# EAGLE design MCU (EAGLE 9.6.2)
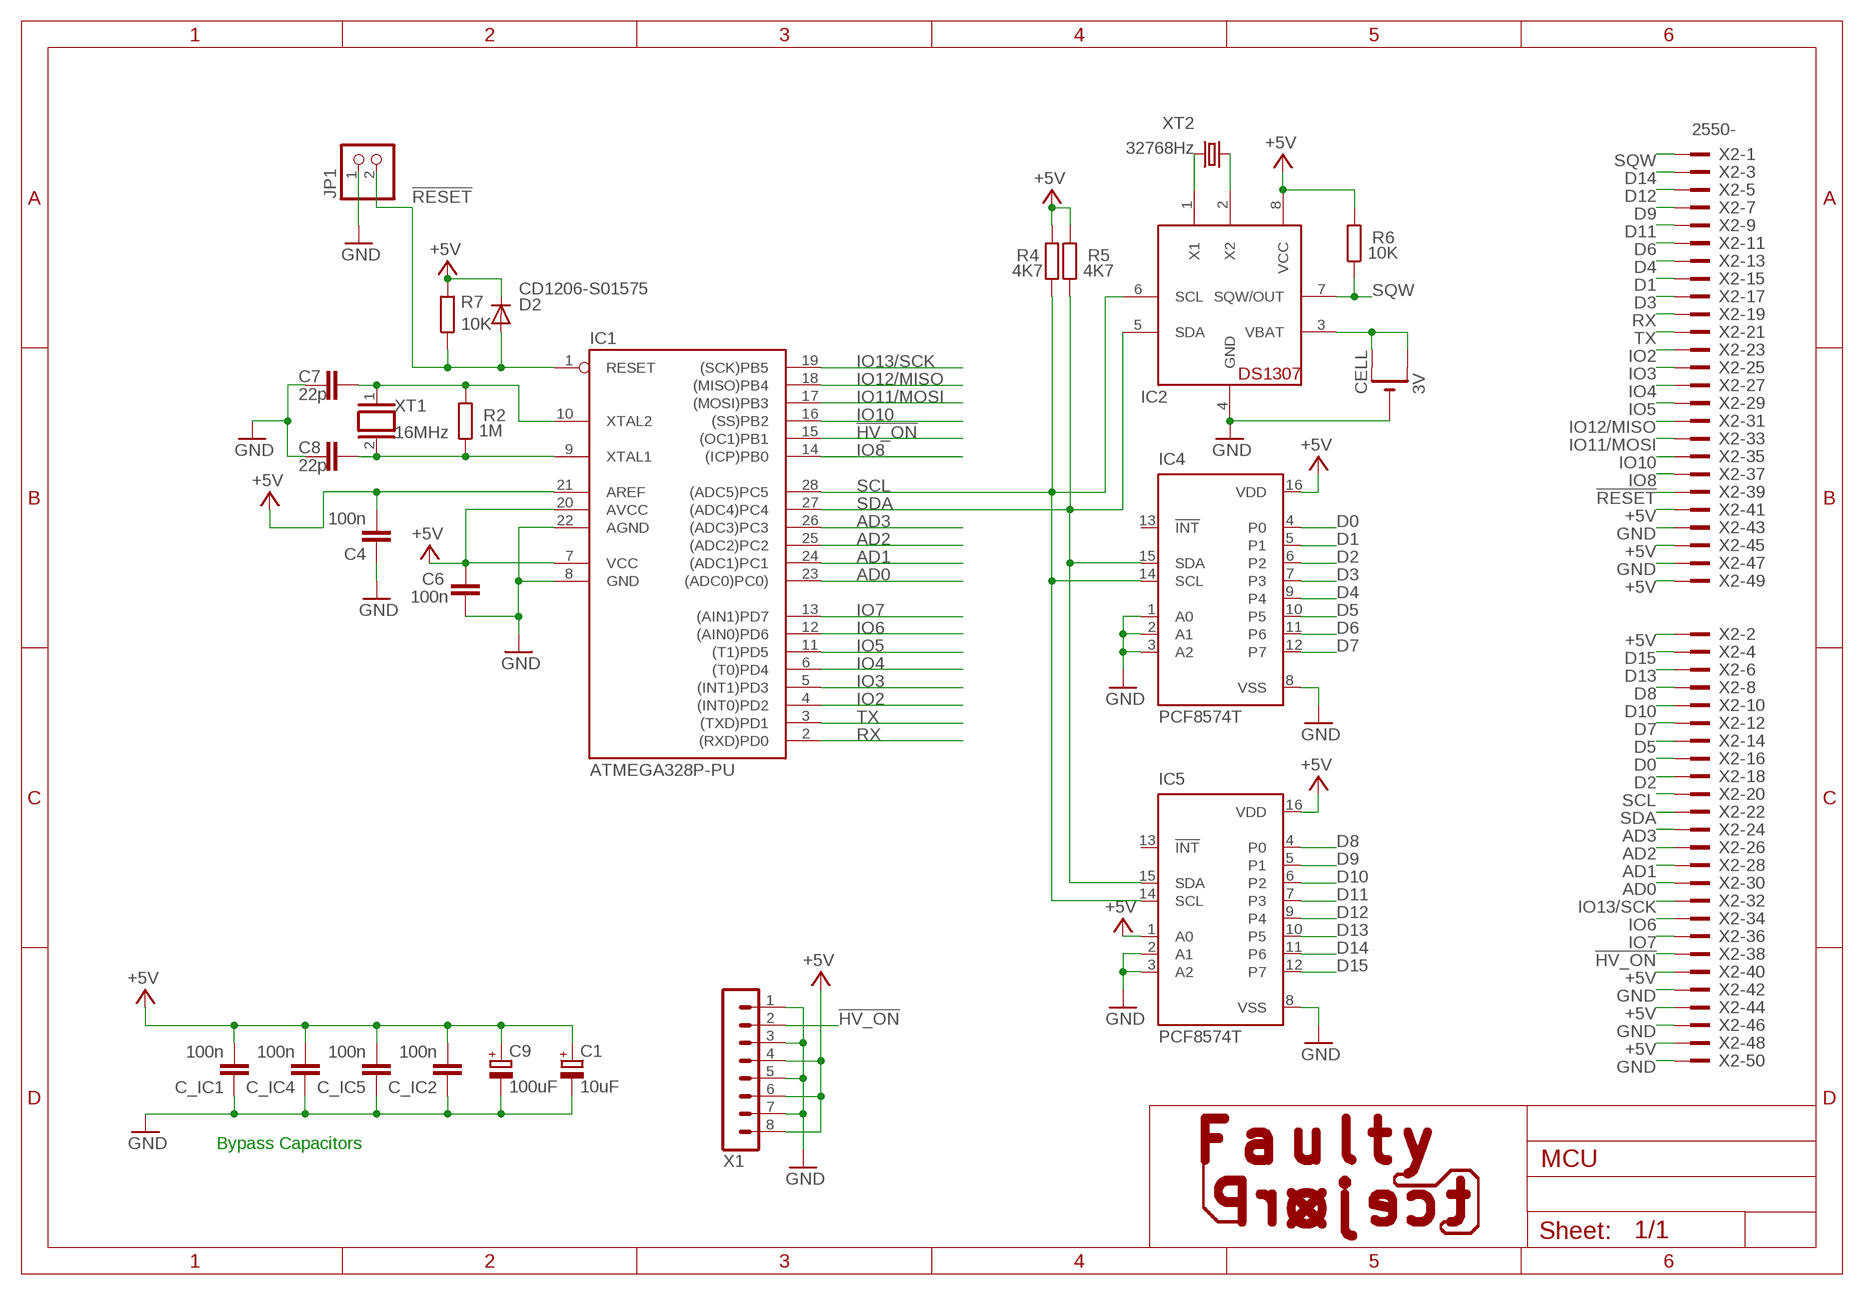
[diagram p0: schematic, sheet 1]

## Parts
C1  10uF  CPOL-EU085CS-1AR  [085CS_1AR]
C4  100n  C-EUC1206  [C1206]
C6  100n  C-EUC1206  [C1206]
C7  22p  C-EUC1206  [C1206]
C8  22p  C-EUC1206  [C1206]
C9  100uF  CPOL-EUE5-10.5  [E5-10,5]
C_IC1  100n  C-EUC1206  [C1206]
C_IC2  100n  C-EUC1206  [C1206]
C_IC4  100n  C-EUC1206  [C1206]
C_IC5  100n  C-EUC1206  [C1206]
CELL  3V  CR2032THM  [CR2032-THRU]
D2  CD1206-S01575  1N4004  [DO41-10]
IC1  ATMEGA328P-PU  [DIL28-3]
IC2  DS1307  [DIL08]
IC4  PCF8574T  [SO16W]
IC5  PCF8574T  [SO16W]
JP1  PINHD-1X2  [1X02]
R2  1M  R-EU_M1206  [M1206]
R4  4K7  R-EU_M1206  [M1206]
R5  4K7  R-EU_M1206  [M1206]
R6  10K  R-EU_M1206  [M1206]
R7  10K  R-EU_M1206  [M1206]
X1  MA08-1W  [MA08-1W]
X2  2550-  [PAK100/2500-50]
XT1  16MHz  XTAL/S  [QS]
XT2  32768Hz  CRYSTALTC26H  [TC26H]

## Nets
!HV_ON: IC1.15((OC1)PB1) X1.2 X2.38
!RESET: D2.A IC1.1(RESET) JP1.2 R7.1 X2.39
+5V [usbvcc]: C1.+ C4.2 C6.2 C9.+ C_IC1.2 C_IC2.2 C_IC4.2 C_IC5.2 D2.C IC1.7(VCC) IC1.20(AVCC) IC1.21(AREF) IC2.8(VCC) IC4.16(VDD) IC5.1(A0) IC5.16(VDD) R4.2 R5.2 R6.2 R7.2 X1.4 X1.6 X1.8 X2.2 X2.40 X2.41 X2.44 X2.45 X2.48 X2.49
AD0: IC1.23((ADC0)PC0)) X2.30
AD1: IC1.24((ADC1)PC1) X2.28
AD2: IC1.25((ADC2)PC2) X2.26
AD3: IC1.26((ADC3)PC3) X2.24
D0: IC4.4(P0) X2.16
D1: IC4.5(P1) X2.15
D2: IC4.6(P2) X2.18
D3: IC4.7(P3) X2.17
D4: IC4.9(P4) X2.13
D5: IC4.10(P5) X2.14
D6: IC4.11(P6) X2.11
D7: IC4.12(P7) X2.12
D8: IC5.4(P0) X2.8
D9: IC5.5(P1) X2.7
D10: IC5.6(P2) X2.10
D11: IC5.7(P3) X2.9
D12: IC5.9(P4) X2.5
D13: IC5.10(P5) X2.6
D14: IC5.11(P6) X2.3
D15: IC5.12(P7) X2.4
GND [gnd]: C1.- C4.1 C6.1 C7.1 C8.1 C9.- C_IC1.1 C_IC2.1 C_IC4.1 C_IC5.1 CELL.- IC1.8(GND) IC1.22(AGND) IC2.4(GND) IC4.1(A0) IC4.2(A1) IC4.3(A2) IC4.8(VSS) IC5.2(A1) IC5.3(A2) IC5.8(VSS) JP1.1 X1.1 X1.3 X1.5 X1.7 X2.42 X2.43 X2.46 X2.47 X2.50
IO2: IC1.4((INT0)PD2) X2.23
IO3: IC1.5((INT1)PD3) X2.25
IO4: IC1.6((T0)PD4) X2.27
IO5: IC1.11((T1)PD5) X2.29
IO6: IC1.12((AIN0)PD6) X2.34
IO7: IC1.13((AIN1)PD7) X2.36
IO8: IC1.14((ICP)PB0) X2.37
IO10: IC1.16((SS)PB2) X2.35
IO11/MOSI: IC1.17((MOSI)PB3) X2.33
IO12/MISO: IC1.18((MISO)PB4) X2.31
IO13/SCK: IC1.19((SCK)PB5) X2.32
RX: IC1.2((RXD)PD0) X2.19
SCL: IC1.28((ADC5)PC5) IC2.6(SCL) IC4.14(SCL) IC5.14(SCL) R4.1 X2.20
SDA: IC1.27((ADC4)PC4) IC2.5(SDA) IC4.15(SDA) IC5.15(SDA) R5.1 X2.22
SQW: IC2.7(SQW/OUT) R6.1 X2.1
TX: IC1.3((TXD)PD1) X2.21
VBAT: CELL.+1(+) CELL.+2(+1) IC2.3(VBAT)
X1_RTC: IC2.1(X1) XT2.2
X2_RTC: IC2.2(X2) XT2.1
XTAL1: C8.2 IC1.9(XTAL1) R2.1 XT1.2
XTAL2: C7.2 IC1.10(XTAL2) R2.2 XT1.1
Unconnected: IC4.13(!INT) IC5.13(!INT)

## Notes on the sheet
- Bypass Capacitors

## Library data of the parts
C1 C9 = rcl:CPOL-EU: POLARIZED CAPACITOR, European symbol
C4 C6-C8 C_IC1 C_IC2 C_IC4 C_IC5 = rcl:C-EU: CAPACITOR, European symbol
CELL = adafruit:CR2032
D2 = diode:1N4004: DIODE general purpose rectifier, 1 A
IC1 = SmartPrj:ATMEGA328P-: MICROCONTROLLER 4 Kbytes FLASH 128 bytes SRAM 256 bytes EEPROM UART 6-channel 10 bit ADC
IC2 = adafruit:DS1307: DS1307 Real time clock (RTC) with battery backup ability. Talk to it via i2c
IC4 IC5 = micro-philips:PCF8574: I2C-Bus Remote 8-bit I/O expander http://www.semiconductors.philips.com/acrobat_download/datasheets/PCF8574_4.pdf; MPN: PCF8574T/3,512; OC_FARNELL: 1201255; OC_NEWARK: 70R6870
JP1 = pinhead:PINHD-1X2: PIN HEADER
R2 R4-R7 = rcl:R-EU_: RESISTOR, European symbol
X1 = con-lstb:MA08-1W: PIN HEADER; OC_FARNELL: unknown; OC_NEWARK: unknown
X2 = con-3m:2550-: 3M (TM) Pak 100 4-Wall Header Source: 3M; OC_FARNELL: unknown; OC_NEWARK: unknown
XT1 = special:XTAL/S: CRYSTAL
XT2 = adafruit:CRYSTAL: CRYSTAL; OC_FARNELL: unknown; OC_NEWARK: unknown

## Net classes
0 default: width 0.254 mm, clearance 0.254 mm
1 power: width 0.61 mm, drill 0.61 mm, clearance 0.254 mm
2 gnd: width 0.305 mm, drill 0.559 mm, clearance 0.254 mm
3 usbvcc: width 0.508 mm, drill 0.61 mm, clearance 0.254 mm
4 aref: width 0.406 mm, drill 0.61 mm, clearance 0.254 mm

## Board
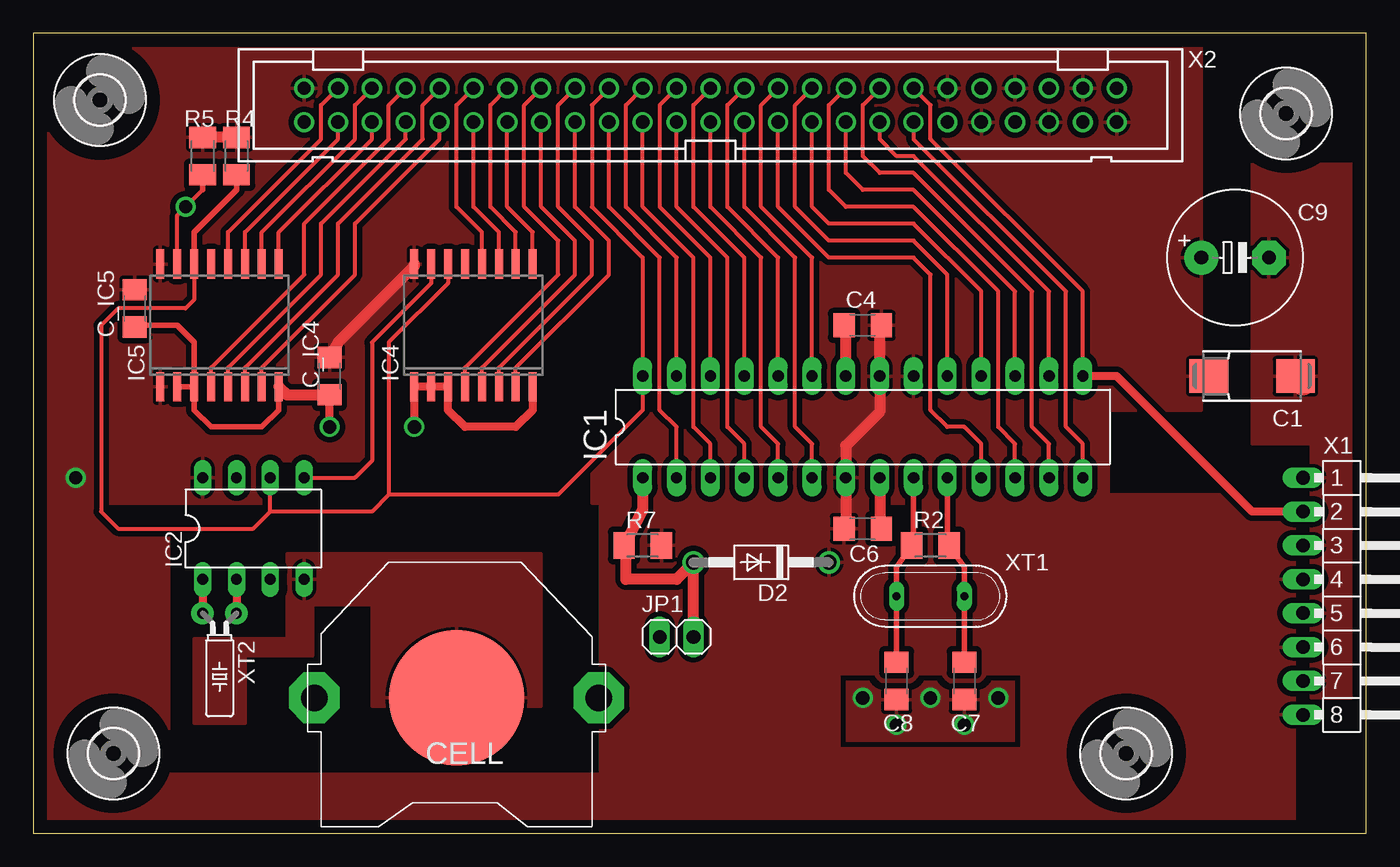
[diagram p1: board, top side]
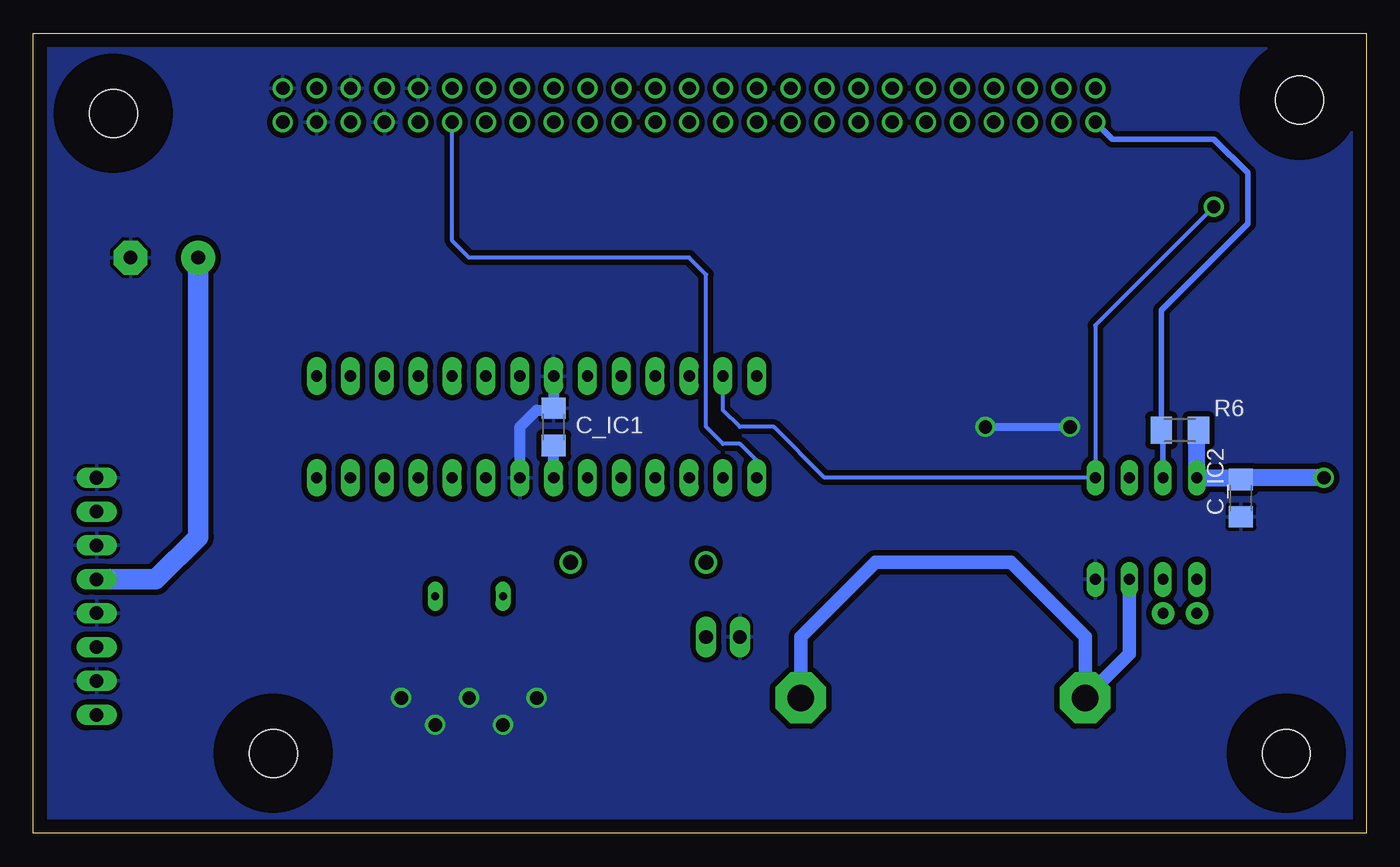
[diagram p2: board, bottom side, seen from below]

Size 100 x 60 mm. Coordinates in mm from the lower left corner, seen from the top.
Outline: 0,0 100,0 100,60 0,60 0,0
Copper layers (1*16): Top 0.035mm / dielectric 1.5mm / Bottom 0.035mm
Design rules "default": minimum track width 10mil, minimum drill 24mil, track to track 8mil, track to pad 8mil, pad to pad 8mil, via to via 8mil, smd to smd 8mil, copper to edge 40mil, drill to drill 8mil, minimum pad ring 10mil, minimum via ring 8mil, stop-mask expansion 4mil, vias tented up to drill 0mil, thermal gap 10mil

### Footprints (pad centres in the part's own frame; a part is rotated, then mirrored left to right if it is on the bottom)
085CS_1AR = smd 2.9 x 2.5: + 3.25,0; - -3.25,0
C1206 = smd 1.6 x 1.8: 1 -1.4,0; 2 1.4,0
E5-10,5 = drill 1.016 pad 2.54: + -2.54,0 | drill 1.016 pad 2.54 octagon: - 2.54,0
CR2032-THRU = drill 2 pad 3.81 octagon: +1 -10.668,0; +2 10.668,0 | smd 10.16 x 10.16: - 0,0
DO41-10 = drill 1.118: A 5.08,0; C -5.08,0
DIL28-3 = drill 0.85 pad 1.422 long: 1 -16.51,-3.81; 2 -13.97,-3.81; 3 -11.43,-3.81; 4 -8.89,-3.81; 5 -6.35,-3.81; 6 -3.81,-3.81; 7 -1.27,-3.81; 8 1.27,-3.81; 9 3.81,-3.81; 10 6.35,-3.81; 11 8.89,-3.81; 12 11.43,-3.81; 13 13.97,-3.81; 14 16.51,-3.81; 15 16.51,3.81; 16 13.97,3.81; 17 11.43,3.81; 18 8.89,3.81; 19 6.35,3.81; 20 3.81,3.81; 21 1.27,3.81; 22 -1.27,3.81; 23 -3.81,3.81; 24 -6.35,3.81; 25 -8.89,3.81; 26 -11.43,3.81; 27 -13.97,3.81; 28 -16.51,3.81
DIL08 = drill 0.813 long: 1 -3.81,-3.81; 2 -1.27,-3.81; 3 1.27,-3.81; 4 3.81,-3.81; 5 3.81,3.81; 6 1.27,3.81; 7 -1.27,3.81; 8 -3.81,3.81
SO16W = smd 0.6 x 2.2: 1 -4.445,-4.6; 2 -3.175,-4.6; 3 -1.905,-4.6; 4 -0.635,-4.6; 5 0.635,-4.6; 6 1.905,-4.6; 7 3.175,-4.6; 8 4.445,-4.6; 9 4.445,4.6; 10 3.175,4.6; 11 1.905,4.6; 12 0.635,4.6; 13 -0.635,4.6; 14 -1.905,4.6; 15 -3.175,4.6; 16 -4.445,4.6
1X02 = drill 1.016 long: 1 -1.27,0; 2 1.27,0
M1206 = smd 1.6 x 2: 1 -1.4,0; 2 1.4,0
3,6 = hole 3.6: 0,0
MA08-1W = drill 1.016 long: 1 -8.89,0; 2 -6.35,0; 3 -3.81,0; 4 -1.27,0; 5 1.27,0; 6 3.81,0; 7 6.35,0; 8 8.89,0
PAK100/2500-50 = drill 1 pad 1.422: 1 -30.48,-1.27; 2 -30.48,1.27; 3 -27.94,-1.27; 4 -27.94,1.27; 5 -25.4,-1.27; 6 -25.4,1.27; 7 -22.86,-1.27; 8 -22.86,1.27; 9 -20.32,-1.27; 10 -20.32,1.27; 11 -17.78,-1.27; 12 -17.78,1.27; 13 -15.24,-1.27; 14 -15.24,1.27; 15 -12.7,-1.27; 16 -12.7,1.27; 17 -10.16,-1.27; 18 -10.16,1.27; 19 -7.62,-1.27; 20 -7.62,1.27; 21 -5.08,-1.27; 22 -5.08,1.27; 23 -2.54,-1.27; 24 -2.54,1.27; 25 0,-1.27; 26 0,1.27; 27 2.54,-1.27; 28 2.54,1.27; 29 5.08,-1.27; 30 5.08,1.27; 31 7.62,-1.27; 32 7.62,1.27; 33 10.16,-1.27; 34 10.16,1.27; 35 12.7,-1.27; 36 12.7,1.27; 37 15.24,-1.27; 38 15.24,1.27; 39 17.78,-1.27; 40 17.78,1.27; 41 20.32,-1.27; 42 20.32,1.27; 43 22.86,-1.27; 44 22.86,1.27; 45 25.4,-1.27; 46 25.4,1.27; 47 27.94,-1.27; 48 27.94,1.27; 49 30.48,-1.27; 50 30.48,1.27
QS = drill 0.61 long: 1 -2.54,0; 2 2.54,0
TC26H = drill 0.813 pad 1.676: 1 -1.27,0; 2 1.27,0

### Placement (x,y rotation side)
C1  91.44,34.29 180 top
C4  62.23,38.1 0 top
C6  62.23,22.86 180 top
C7  69.85,11.43 90 top
C8  64.77,11.43 90 top
C9  90.17,43.18 0 top
C_IC1  60.96,30.48 270 bottom
C_IC2  9.4,25.15 90 bottom
C_IC4  22.23,34.29 90 top
C_IC5  7.62,39.37 90 top
CELL  31.75,10.16 180 top
D2  54.61,20.32 180 top
IC1  62.23,30.48 0 top
IC2  16.51,22.86 0 top
IC4  33.02,38.1 0 top
IC5  13.97,38.1 0 top
JP1  48.26,14.73 0 top
R2  67.31,21.59 0 top
R4  15.24,50.8 90 top
R5  12.7,50.8 90 top
R6  13.97,30.23 0 bottom
R7  45.72,21.59 0 top
U$1  [3,6]  5,55 0 top
U$2  [3,6]  94,54 0 top
U$3  [3,6]  6,6 0 top
U$4  [3,6]  82,6 0 top
X1  95.25,17.78 270 top
X2  50.8,54.61 0 top
XT1  67.31,17.78 180 top
XT2  13.97,16.51 180 top

### Tracks (layer width: path | path; a pad name or v marks a point on that pad's centre or on a via)
!HV_ON
  Top 0.305: IC1.15 78.74,40.64 67.31,52.07 67.31,54.61 X2.38
  Top 0.61: X1.2 91.44,24.13 81.28,34.29 IC1.15
!RESET
  Top 0.813: IC1.1 45.72,24.26 R7.1 44.45,21.46 44.45,19.05 48.26,19.05 D2.A JP1.2
  Bottom 0.305: IC1.1 45.72,27.94 46.99,29.21 48.26,29.21 49.53,30.48 49.53,41.91 50.8,43.18 67.31,43.18 68.58,44.45 X2.39
+5V  (via drill 1)
  Top 0.813: C4.2 63.5,37.72 IC1.21 63.5,31.62 C_IC1.2 IC1.7 60.96,23.24 C6.2 | IC4.16 28.57,42.55 22.86,36.83 C_IC4.2 | R4.2 R5.2
  Bottom 0.813: IC1.7 C_IC1.2
  Bottom 1.27: v3.17,26.67 9.27,26.67 | 9.27,26.67 C_IC2.2 | 9.27,26.67 IC2.8 12.7,30.1 R6.2
  Bottom 1.524: X1.4 90.81,19.05 87.63,22.23 C9.+
  pour Top (isolate 0.406, rank 2): 80.64,31.75 87.63,31.75 87.63,59.05 0,59.05 0,24.77 17.78,24.77 17.78,27.94 41.91,27.94 41.91,24.77 80.64,24.77
  pour Top (isolate 0.406, rank 2): 0,25.4 0,0 94.61,0 94.61,25.4 42.55,25.4 42.55,4.45 10.16,4.45 10.16,25.4
AD0
  Top 0.305: IC1.23 58.42,43.18 54.61,46.99 54.61,54.61 X2.30
AD1
  Top 0.305: IC1.24 55.88,43.18 52.07,46.99 52.07,54.61 X2.28
AD2
  Top 0.305: IC1.25 53.34,43.18 49.53,46.99 49.53,54.61 X2.26
AD3
  Top 0.305: IC1.26 50.8,43.18 46.99,46.99 46.99,54.61 X2.24
D0
  Top 0.305: IC4.4 32.38,34.92 39.37,41.91 39.37,44.45 36.83,46.99 36.83,54.61 X2.16
D1
  Top 0.305: IC4.5 33.66,34.92 40.64,41.91 40.64,44.45 38.1,46.99 X2.15
D2
  Top 0.305: IC4.6 34.92,34.92 41.91,41.91 41.91,44.45 39.37,46.99 39.37,54.61 X2.18
D3
  Top 0.305: IC4.7 36.2,34.92 43.18,41.91 43.18,44.45 40.64,46.99 X2.17
D4
  Top 0.305: X2.13 35.56,46.99 37.47,45.09 IC4.9
D5
  Top 0.305: X2.14 34.29,54.61 34.29,46.99 36.2,45.09 IC4.10
D6
  Top 0.305: X2.11 33.02,46.99 34.92,45.09 IC4.11
D7
  Top 0.305: X2.12 31.75,54.61 31.75,46.99 33.66,45.09 IC4.12
D8
  Top 0.305: IC5.4 13.34,34.92 20.32,41.91 20.32,45.72 26.67,52.07 26.67,54.61 X2.8
D9
  Top 0.305: IC5.5 14.61,34.92 21.59,41.91 21.59,45.72 27.94,52.07 X2.7
D10
  Top 0.305: IC5.6 15.88,34.92 22.86,41.91 22.86,45.72 29.21,52.07 29.21,54.61 X2.10
D11
  Top 0.305: IC5.7 17.14,34.92 24.13,41.91 24.13,45.72 30.48,52.07 X2.9
D12
  Top 0.305: IC5.9 18.41,45.09 25.4,52.07 X2.5
D13
  Top 0.305: IC5.10 17.14,45.09 24.13,52.07 24.13,54.61 X2.6
D14
  Top 0.305: IC5.11 15.88,45.09 22.86,52.07 X2.3
D15
  Top 0.305: IC5.12 14.61,45.09 21.59,52.07 21.59,54.61 X2.4
GND  (via drill 1, 1 pad 0.25)
  Top 0.406: C_IC5.1 7.75,38.1 10.79,38.1 12.06,36.83 IC5.3 | IC5.2 IC5.3 | IC5.3 12.06,31.75 13.34,30.48 17.14,30.48 18.41,31.75 IC5.8
  Top 0.61: IC4.8 37.47,31.75 36.2,30.48 32.38,30.48 31.11,31.75 IC4.3 IC4.2 IC4.1 v28.57,30.48 | v22.23,30.48 C_IC4.1
  Top 0.813: IC1.8 63.5,22.99 C6.1 | IC1.22 60.96,37.97 C4.1 | C8.1 64.9,10.16 | IC5.8 19.02,32.89 C_IC4.1
  Top 1.778: C1.- 95.25,33.73
  Bottom 0.61: v28.57,30.48 v22.23,30.48
  Bottom 0.813: IC1.22 C_IC1.1 61.09,31.75 62.23,31.75 63.5,30.48 IC1.8
  other vias: 67.31,10.16 72.39,10.16 69.85,8.13 64.77,8.13 62.23,10.16
  pour Bottom (isolate 0.406, rank 2): 0,0 99.06,0 99.06,59.69 0,59.69
  pour Top (isolate 0.61, rank 2): 12.06,8.26 12.06,14.61 19.05,14.61 19.05,20.95 38.1,20.95 38.1,9.53 25.4,9.53 25.4,17.14 20.95,17.14 20.95,13.34 15.88,13.34 15.88,8.26
  pour Top (isolate 0.406): 99.06,50.16 91.44,50.16 91.44,29.21 95.89,29.21 95.89,10.16 99.06,10.16
  pour Top (isolate 1.27): 60.96,11.43 73.66,11.43 73.66,6.86 60.96,6.86
IO2
  Top 0.305: IC1.4 53.34,29.21 52.07,30.48 52.07,43.18 48.26,46.99 X2.23
IO3
  Top 0.305: IC1.5 55.88,29.21 54.61,30.48 54.61,43.18 50.8,46.99 X2.25
IO4
  Top 0.305: IC1.6 58.42,29.21 57.15,30.48 57.15,43.18 53.34,46.99 X2.27
IO5
  Top 0.305: IC1.11 71.12,29.21 69.85,30.48 68.58,30.48 67.31,31.75 67.31,41.91 66.04,43.18 59.69,43.18 55.88,46.99 X2.29
IO6
  Top 0.305: IC1.12 73.66,29.21 72.39,30.48 72.39,40.64 66.04,46.99 60.96,46.99 59.69,48.26 59.69,54.61 X2.34
IO7
  Top 0.305: IC1.13 76.2,29.21 74.93,30.48 74.93,40.64 66.04,49.53 63.5,49.53 62.23,50.8 62.23,54.61 X2.36
IO8
  Top 0.305: IC1.14 78.74,29.21 77.47,30.48 77.47,40.64 66.04,52.07 X2.37
IO10
  Top 0.305: IC1.16 76.2,40.64 66.04,50.8 64.77,50.8 63.5,52.07 X2.35
IO11/MOSI
  Top 0.305: IC1.17 73.66,40.64 66.04,48.26 62.23,48.26 60.96,49.53 X2.33
IO12/MISO
  Top 0.305: IC1.18 71.12,40.64 66.04,45.72 59.69,45.72 58.42,46.99 X2.31
IO13/SCK
  Top 0.305: IC1.19 68.58,41.91 66.04,44.45 59.69,44.45 57.15,46.99 57.15,54.61 X2.32
RX
  Top 0.305: IC1.2 48.26,30.48 46.99,31.75 46.99,43.18 43.18,46.99 X2.19
SCL
  Top 0.305: 26.67,25.4 26.67,36.83 31.11,41.27 IC4.14 | 26.67,25.4 25.4,24.13 17.78,24.13 | 17.78,25.4 IC2.6 17.78,24.13 | 26.67,25.4 39.37,25.4 45.72,31.75 IC1.28 45.72,43.18 41.91,46.99 41.91,54.61 X2.20 | IC5.14 12.06,40.01 11.43,39.37 6.35,39.37 5.08,38.1 5.08,24.13 6.35,22.86 16.51,22.86 17.78,24.13
  Top 0.406: IC5.14 12.06,45.09 15.24,48.26 R4.1
SDA  (via drill 1 pad 0.25)
  Top 0.305: IC4.15 29.84,41.27 25.4,36.83 25.4,27.94 24.13,26.67 IC2.5 | IC1.27 48.26,43.18 44.45,46.99 44.45,54.61 X2.22 | 12.7,48.26 v11.43,46.99 10.79,46.35 IC5.15
  Top 0.406: 12.7,48.26 R5.1
  Bottom 0.305: IC1.27 48.26,31.75 46.99,30.48 44.45,30.48 40.64,26.67 IC2.5 20.32,38.1 v11.43,46.99
SQW
  Bottom 0.406: X2.1 19.05,52.07 11.43,52.07 8.89,49.53 8.89,45.72 15.37,39.24 R6.1 15.24,30.1 IC2.7
TX
  Top 0.305: IC1.3 50.8,29.21 49.53,30.48 49.53,43.18 45.72,46.99 X2.21
VBAT
  Bottom 1.016: CELL.+1 42.42,14.73 36.83,20.32 26.67,20.32 21.08,14.73 CELL.+2 17.78,13.46 IC2.3
X1_RTC
  Top 0.61: IC2.1 XT2.2
X2_RTC
  Top 0.61: IC2.2 XT2.1
XTAL1
  Top 0.406: IC1.9 66.04,21.97 R2.1 64.77,19.94 XT1.2 C8.2
XTAL2
  Top 0.406: IC1.10 68.58,21.97 R2.2 69.85,19.94 XT1.1 C7.2

### Text on the board
Measures: grid:0.025